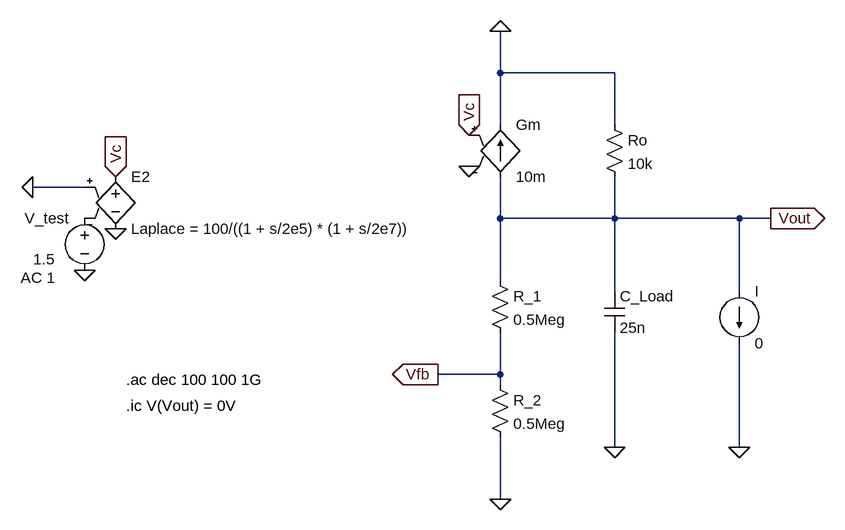
[diagram p0: schematic tut7ques3.asc]
tut7ques3.asc, the LTspice schematic file:
Version 4
SHEET 1 2400 680
WIRE 1728 -528 1728 -592
WIRE 1904 -528 1728 -528
WIRE 1728 -448 1728 -528
WIRE 1904 -448 1904 -528
WIRE 1088 -352 1008 -352
WIRE 1728 -304 1728 -368
WIRE 1904 -304 1904 -368
WIRE 1904 -304 1728 -304
WIRE 2096 -304 1904 -304
WIRE 2144 -304 2096 -304
WIRE 1728 -208 1728 -304
WIRE 1904 -192 1904 -304
WIRE 2096 -192 2096 -304
WIRE 1728 -64 1728 -128
WIRE 1728 -64 1632 -64
WIRE 1728 -48 1728 -64
WIRE 1904 48 1904 -128
WIRE 2096 48 2096 -112
WIRE 1728 128 1728 32
FLAG 2144 -304 Vout
IOPIN 2144 -304 Out
FLAG 2096 48 0
FLAG 1728 128 0
FLAG 1680 -384 0
FLAG 1680 -432 Vc
IOPIN 1680 -432 In
FLAG 1904 48 0
FLAG 1008 -352 0
FLAG 1632 -64 Vfb
IOPIN 1632 -64 Out
FLAG 1088 -224 0
FLAG 1136 -368 Vc
IOPIN 1136 -368 In
FLAG 1136 -288 0
FLAG 1728 -592 0
SYMBOL g 1728 -464 R0
SYMATTR InstName Gm
SYMATTR Value 10m
SYMBOL res 1888 -464 R0
SYMATTR InstName Ro
SYMATTR Value 10k
SYMBOL current 2096 -192 R0
WINDOW 123 0 0 Left 0
WINDOW 39 0 0 Left 0
SYMATTR InstName I
SYMATTR Value 0
SYMBOL res 1712 -224 R0
SYMATTR InstName R_1
SYMATTR Value 0.5Meg
SYMBOL res 1712 -64 R0
SYMATTR InstName R_2
SYMATTR Value 0.5Meg
SYMBOL cap 1888 -192 R0
SYMATTR InstName C_Load
SYMATTR Value 25n
SYMBOL voltage 1088 -320 M0
WINDOW 123 45 107 Left 2
WINDOW 39 0 0 Left 0
WINDOW 3 45 79 Left 2
SYMATTR Value2 AC 1
SYMATTR Value 1.5
SYMATTR InstName V_test
SYMBOL e 1136 -384 R0
SYMATTR InstName E2
SYMATTR Value Laplace = 100/((1 + s/2e5) * (1 + s/2e7))
TEXT 1152 -56 Left 2 !.ac dec 100 100 1G
TEXT 1152 -16 Left 2 !.ic V(Vout) = 0V

The netlist it stands for:
* tut7ques3.asc
Gm Vout 0 Vc 0 10m
Ro 0 Vout 10k
I Vout 0 0
R_1 Vout Vfb 0.5Meg
R_2 Vfb 0 0.5Meg
C_Load Vout 0 25n
V_test P001 0 1.5 AC 1
E2 Vc 0 0 P001 Laplace = 100/((1 + s/2e5) * (1 + s/2e7))
.ac dec 100 100 1G
.ic V(Vout) = 0V
.backanno
.end